# Altium schematic sheet DIPSY_UL1K16_LED5.SchDoc: XMOD FT2232H
size A4; Organization: Trenz Electronic GmbH; DocumentNumber: DIPSY; Revision: 01; SheetNumber: 1; SheetTotal: 3; Date: 2015-01-06; Author: Antti Lukats; DrawnBy: Antti Lukats; Engineer: Antti Lukats
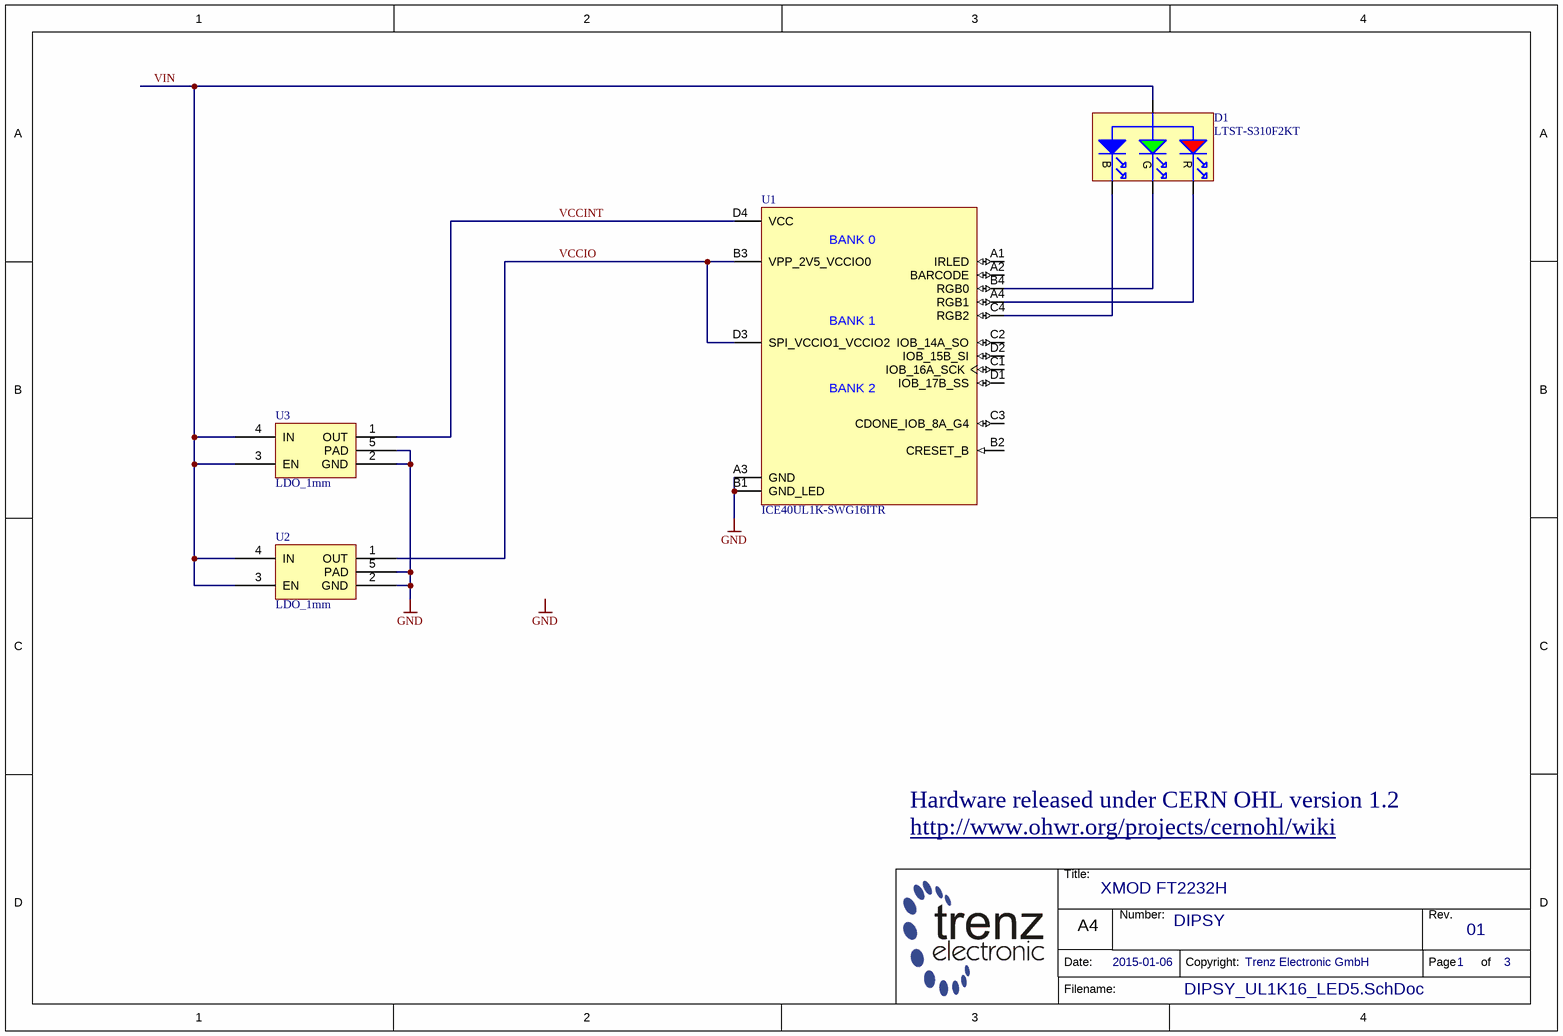
[diagram p0: DIPSY_UL1K16_LED5.SchDoc]

## Parts
D1  LTST-S310F2KT  [LTST-S310F2KT]
U1  ICE40UL1K-SWG16ITR  [BGA16C35P4X4_140X140X49B21N]
U2  LDO_1mm  [DFN65P100X45-4N]
U3  LDO_1mm  [DFN65P100X45-4N]

## Nets
GND: U1.A3(GND) U1.B1(GND_LED) U2.2(GND) U2.5(PAD) U3.2(GND) U3.5(PAD)
VCCINT: U1.D4(VCC) U3.1(OUT)
VCCIO: U1.B3(VPP_2V5_VCCIO0) U1.D3(SPI_VCCIO1_VCCIO2) U2.1(OUT)
VIN: D1.4(ANODE) U2.3(EN) U2.4(IN) U3.3(EN) U3.4(IN)
NetD1_1: D1.1(RED) U1.A4(RGB1)
NetD1_2: D1.2(GREEN) U1.B4(RGB0)
NetD1_3: D1.3(BLUE) U1.C4(RGB2)

Not connected (* = marked no-connect by the designer): U1 A1(IRLED) A2(BARCODE) B2(CRESET_B) C1(IOB_16A_SCK) C2(IOB_14A_SO) C3(CDONE_IOB_8A_G4) D1(IOB_17B_SS) D2(IOB_15B_SI)

## Notes on the sheet
- Hardware released under CERN OHL version 1.2
- http://www.ohwr.org/projects/cernohl/wiki
- Labels drawn without touching a wire or pin: GND
- Title:
- Number:
- Rev.
- Date:
- A4
- Copyright:
- Page
- of
- Filename:
- (in symbol 26737) BANK 0; BANK 1; BANK 2
- (in symbol LTST-S310F2KT) B; G; R

## Library data of the parts
U1 = 26737: AN: 26737; Mixed: SMT; Case: WLCSP16; HelpURL: B:\AD\adlib\datasheet\ICE40